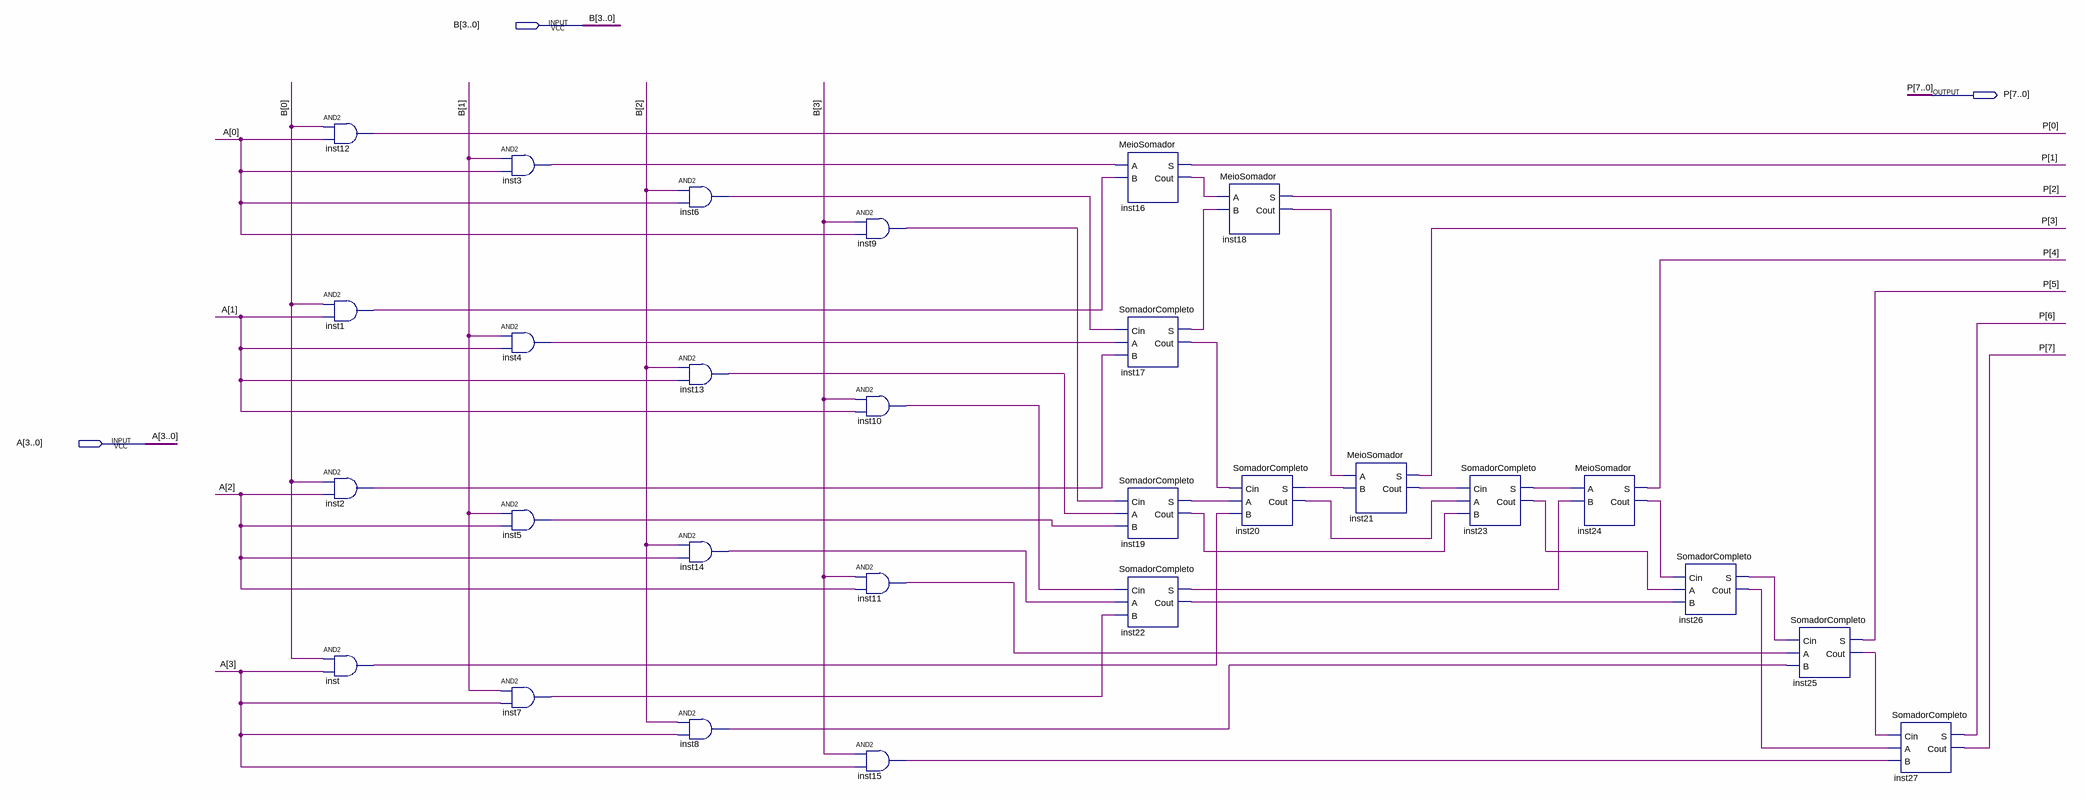
[diagram p0: schematic sheet]
// Quartus schematic Multiplicador4x4.bdf as structural Verilog: 28 symbols, 3 pins
module Multiplicador4x4 (
  input  [3:0] B,
  input  [3:0] A,
  output [7:0] P
);

  wire inst1_out, inst2_out, inst3_out, inst4_out, inst5_out, inst6_out, inst7_out, inst8_out, inst9_out,
       inst10_out, inst11_out, inst13_out, inst14_out, inst15_out, inst16_cout, inst17_cout, inst17_s,
       inst18_cout, inst19_cout, inst19_s, inst20_cout, inst20_s, inst21_cout, inst22_cout, inst22_s,
       inst23_cout, inst23_s, inst24_cout, inst25_cout, inst26_cout, inst26_s, inst_out;

  and inst12 (P[0], B[0], A[0]);
  and inst1 (inst1_out, B[0], A[1]);
  and inst2 (inst2_out, B[0], A[2]);
  and inst (inst_out, B[0], A[3]);
  and inst3 (inst3_out, B[1], A[0]);
  and inst4 (inst4_out, B[1], A[1]);
  and inst5 (inst5_out, B[1], A[2]);
  and inst7 (inst7_out, B[1], A[3]);
  and inst6 (inst6_out, B[2], A[0]);
  and inst13 (inst13_out, B[2], A[1]);
  and inst14 (inst14_out, B[2], A[2]);
  and inst8 (inst8_out, B[2], A[3]);
  and inst9 (inst9_out, B[3], A[0]);
  and inst10 (inst10_out, B[3], A[1]);
  and inst11 (inst11_out, B[3], A[2]);
  and inst15 (inst15_out, B[3], A[3]);
  MeioSomador inst16 (.A(inst3_out), .B(inst1_out), .S(P[1]), .Cout(inst16_cout));
  SomadorCompleto inst17 (.Cin(inst6_out), .A(inst4_out), .B(inst2_out), .S(inst17_s), .Cout(inst17_cout));
  SomadorCompleto inst19 (.Cin(inst9_out), .A(inst13_out), .B(inst5_out), .S(inst19_s), .Cout(inst19_cout));
  SomadorCompleto inst22 (.Cin(inst10_out), .A(inst14_out), .B(inst7_out), .S(inst22_s), .Cout(inst22_cout));
  MeioSomador inst18 (.A(inst16_cout), .B(inst17_s), .S(P[2]), .Cout(inst18_cout));
  SomadorCompleto inst20 (.Cin(inst17_cout), .A(inst19_s), .B(inst_out), .S(inst20_s), .Cout(inst20_cout));
  MeioSomador inst21 (.A(inst18_cout), .B(inst20_s), .S(P[3]), .Cout(inst21_cout));
  SomadorCompleto inst23 (.Cin(inst21_cout), .A(inst20_cout), .B(inst19_cout), .S(inst23_s), .Cout(inst23_cout));
  MeioSomador inst24 (.A(inst23_s), .B(inst22_s), .S(P[4]), .Cout(inst24_cout));
  SomadorCompleto inst26 (.Cin(inst24_cout), .A(inst23_cout), .B(inst22_cout), .S(inst26_s), .Cout(inst26_cout));
  SomadorCompleto inst25 (.Cin(inst26_s), .A(inst11_out), .B(inst8_out), .S(P[5]), .Cout(inst25_cout));
  SomadorCompleto inst27 (.Cin(inst25_cout), .A(inst26_cout), .B(inst15_out), .S(P[6]), .Cout(P[7]));
endmodule
